# Altium schematic sheet RS485.SchDoc
size 297 x 209 mm
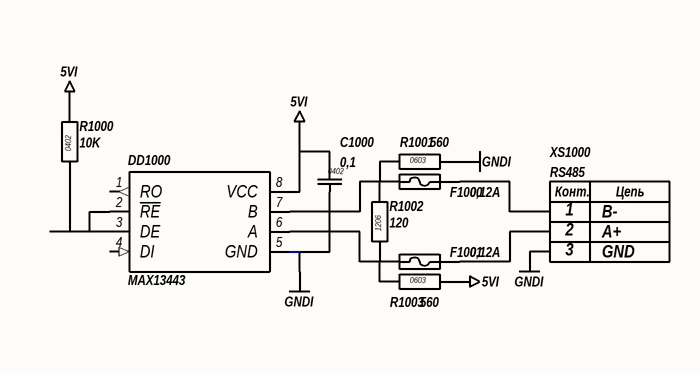
[diagram p0: RS485.SchDoc]

## Parts
C1000  0,1  [CAP0402]
DD1000  MAX13443  [SO8-3.9]
F1000  0,12A  [MF-NSMF]
F1001  0,12A  [MF-NSMF]
R1000  10K  [RES0402]
R1001  560  [RES0603]
R1002  120  [RES1206]
R1003  560  [RES0603]
XS1000  RS485  [MW-3M]

## Nets
5VI: C1000.1 DD1000.8(VCC) R1000.2 R1003.2
GNDI: C1000.2 DD1000.5(GND) R1001.2 XS1000.3(GND)
NetDD1000_2: DD1000.2(~{RE}) DD1000.3(DE) R1000.1
NetDD1000_6: DD1000.6(A) F1001.1 R1002.1 R1003.1
NetDD1000_7: DD1000.7(B) F1000.1 R1001.1 R1002.2
NetF1000_2: F1000.2 XS1000.1(B-)
NetF1001_2: F1001.2 XS1000.2(A+)

Not connected (* = marked no-connect by the designer): DD1000 1(RO) 4(DI)

## Notes on the sheet
- (in symbol Разъем3_1) Конт.; Цепь

## Library data of the parts
C1000 = CAP_0402: Конденсатор чип; Тип корпуса: 0402; Тип монтажа: Поверхностный; Номинал: 0,1; Тип компонента: Конденсатор чип; Value: 0,1
DD1000 = MAX13443: Интерфейс RS485; Тип корпуса: SO8; Тип монтажа: Поверхностный; Характеристики: 10Мбит/с, 128 устройств на линии; Производитель: Maxim Semiconductor; Наименование: MAX13443; Тип компонента: Интерфейс RS485
F1000 F1001 = MF-NSMF: Предохранитель самовосстанавливающийся; Тип монтажа: Поверхностный; Производитель: Bourns; Value: 0,12A; Наименование: MF-NSMF; Номинал: 0,12A; Тип компонента: Предохранитель самовосстанавливающийся; Тип корпуса: MF-NSMF
R1000 = RES_0402: Резистор чип; Тип корпуса: 0402; Тип монтажа: Поверхностный; Характеристики: 0.062Вт 50В; Номинал: 10K; Тип компонента: Резистор чип; Value: 10K
R1001 R1003 = RES_0603: Резистор чип; Тип корпуса: 0603; Тип монтажа: Поверхностный; Характеристики: 0.1Вт 50В; Номинал: 560; Тип компонента: Резистор чип; Value: 560
R1002 = RES_1206: Резистор чип; Тип корпуса: 1206; Тип монтажа: Поверхностный; Характеристики: 0.25Вт 200В; Номинал: 120; Тип компонента: Резистор чип; Value: 120
XS1000 = Разъем3_1: Разъем